# EAGLE schematic untitled (EAGLE 7.7.0)
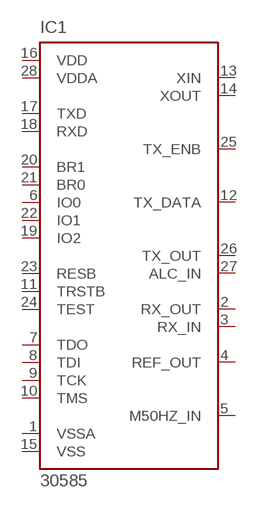
[diagram p0: schematic, sheet 1]

## Parts
IC1  30585  [PLCC28S]
Unconnected: IC1.1(VSSA) IC1.2(RX_OUT) IC1.3(RX_IN) IC1.4(REF_OUT) IC1.5(M50HZ_IN) IC1.6(IO0) IC1.7(TDO) IC1.8(TDI) IC1.9(TCK) IC1.10(TMS) IC1.11(TRSTB) IC1.12(TX_DATA) IC1.13(XIN) IC1.14(XOUT) IC1.15(VSS) IC1.16(VDD) IC1.17(TXD) IC1.18(RXD) IC1.19(IO2) IC1.20(BR1) IC1.21(BR0) IC1.22(IO1) IC1.23(RESB) IC1.24(TEST) IC1.25(TX_ENB) IC1.26(TX_OUT) IC1.27(ALC_IN) IC1.28(VDDA)

## Library data of the parts
IC1 = amis:30585: AMIS-30585 S-FSK PLC Modem Source: http://www.amis.com/pdf/amis_30585_ds.pdf; OC_FARNELL: unknown; OC_NEWARK: unknown